# EAGLE schematic CMOS Trumpet (EAGLE 7.3.0)
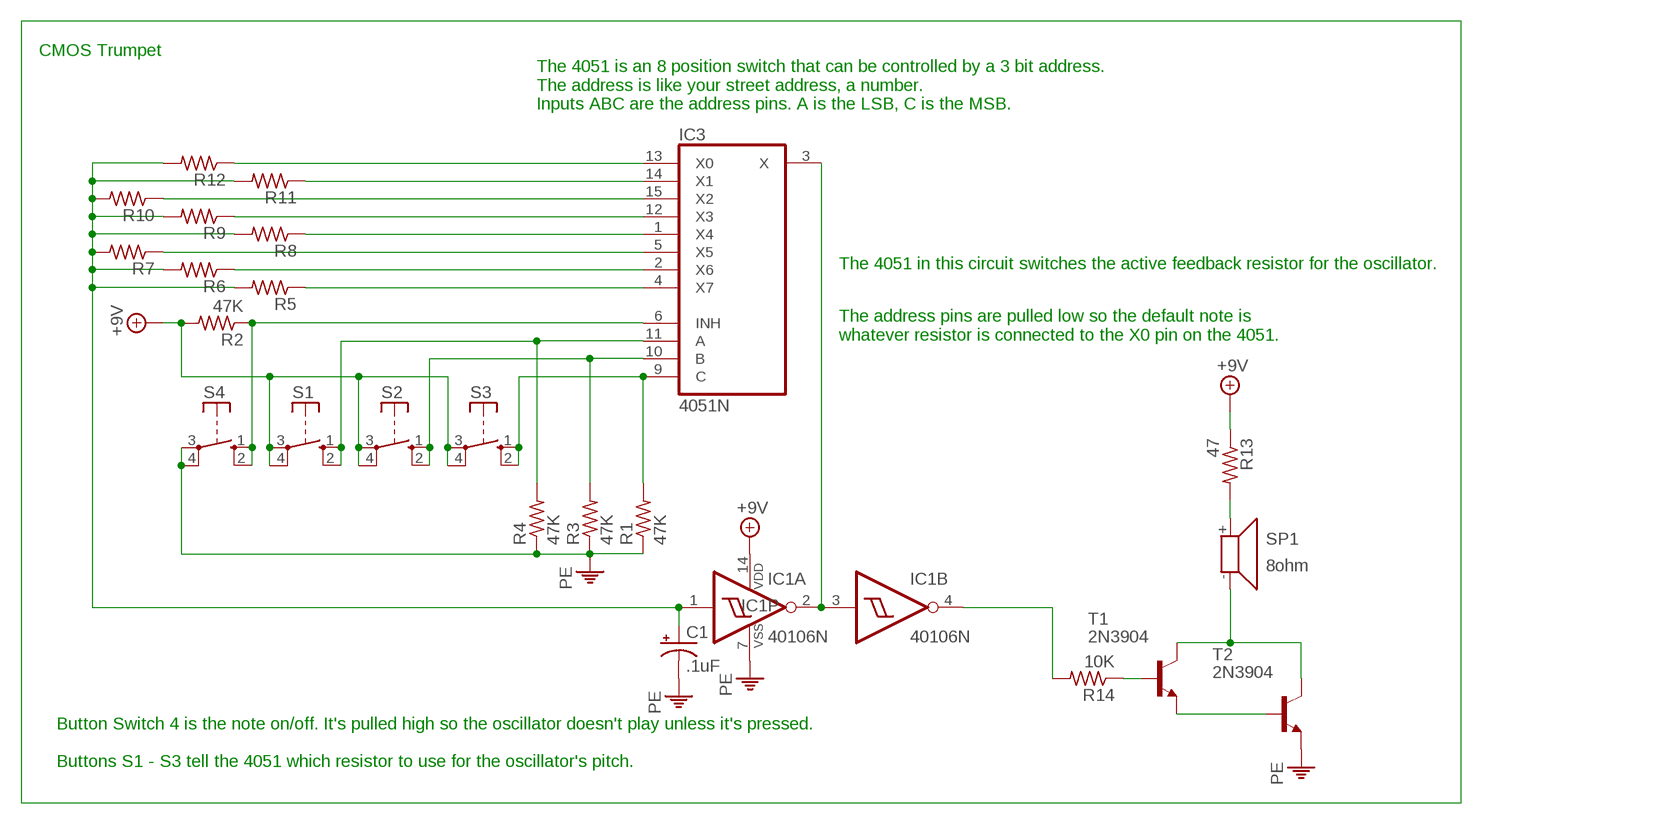
[diagram p0: schematic, sheet 1]

## Parts
C1  .1uF  CPOL-USE2,5-6E  [E2,5-6E]
IC1  40106N  [DIL14]
IC3  4051N  [DIL16]
R1  47K  R-US_0204/7  [0204/7]
R2  47K  R-US_0204/7  [0204/7]
R3  47K  R-US_0204/7  [0204/7]
R4  47K  R-US_0204/7  [0204/7]
R5  R-US_0204/7  [0204/7]
R6  R-US_0204/7  [0204/7]
R7  R-US_0204/7  [0204/7]
R8  R-US_0204/7  [0204/7]
R9  R-US_0204/7  [0204/7]
R10  R-US_0204/7  [0204/7]
R11  R-US_0204/7  [0204/7]
R12  R-US_0204/7  [0204/7]
R13  47  R-US_0204/7  [0204/7]
R14  10K  R-US_0204/7  [0204/7]
S1  RACON12  [RACON12]
S2  RACON12  [RACON12]
S3  RACON12  [RACON12]
S4  RACON12  [RACON12]
SP1  8ohm  SMS-1308MS-2-R  [SMS-1308MS-2-R]
T1  2N3904  [TO92]
T2  2N3904  [TO92]

## Nets
+9V: IC1.14(P:VDD) R2.2 R13.1 S1.3(P) S1.4(P) S2.3(P) S2.4(P) S3.3(P) S3.4(P)
N$1: IC3.10(B) R3.2 S2.1(S) S2.2(S)
N$2: IC1.4(B:O) R14.2
N$3: IC1.2(A:O) IC1.3(B:I) IC3.3(X)
N$4: IC3.6(INH) R2.1 S4.1(S) S4.2(S)
N$5: IC3.11(A) R4.2 S1.1(S) S1.2(S)
N$6: R14.1 T1.2(B)
N$7: IC3.9(C) R1.2 S3.1(S) S3.2(S)
N$8: T1.3(E) T2.2(B)
N$9: SP1.- T1.1(C) T2.1(C)
N$10: R13.2 SP1.+
N$19: IC3.13(X0) R12.1
N$20: IC3.14(X1) R11.1
N$21: IC3.15(X2) R10.1
N$22: IC3.12(X3) R9.1
N$23: IC3.1(X4) R8.1
N$24: IC3.5(X5) R7.1
N$25: IC3.2(X6) R6.1
N$26: IC3.4(X7) R5.1
N$28: C1.+ IC1.1(A:I) R5.2 R6.2 R7.2 R8.2 R9.2 R10.2 R11.2 R12.2
PE: C1.- IC1.7(P:VSS) R1.1 R3.1 R4.1 S4.3(P) S4.4(P) T2.3(E)
Unconnected: IC1.5(C:I) IC1.6(C:O) IC1.8(D:O) IC1.9(D:I) IC1.10(E:O) IC1.11(E:I) IC1.12(F:O) IC1.13(F:I)

## Notes on the sheet
- CMOS Trumpet
- The 4051 is an 8 position switch that can be controlled by a 3 bit address.
  The address is like your street address, a number.
  Inputs ABC are the address pins. A is the LSB, C is the MSB.
- The 4051 in this circuit switches the active feedback resistor for the oscillator.
- The address pins are pulled low so the default note is
  whatever resistor is connected to the X0 pin on the 4051.
- Button Switch 4 is the note on/off. It's pulled high so the oscillator doesn't play unless it's pressed.
  
  Buttons S1 - S3 tell the 4051 which resistor to use for the oscillator's pitch.

## Power pins joined to a net without a drawn wire
GND: IC3.8(GND)
VCC: IC3.16(VCC)
VEE: IC3.7(VEE)

## Library data of the parts
C1 = rcl:CPOL-US: POLARIZED CAPACITOR, American symbol
IC1 = 40xx:40106: Hex SCHMITT TRIGGER
IC3 = 40xx:4051: 8-channel ANALOG MULTIPLEXER
R1-R14 = rcl:R-US_: RESISTOR, American symbol
S1-S4 = switch-misc:RACON12: ITT SWITCH
SP1 = speaker:SMS-1308MS-2-R: Speaker 13 x 13mm, 8 Ohm, 0.7W Source: pui audio inc. SMS-1308MS-2-R.pdf
T1 T2 = transistor:2N3904: NPN TRANSISTOR